# Altium schematic sheet Voeding.SchDoc
size A4; SheetNumber: 3; SheetTotal: 5
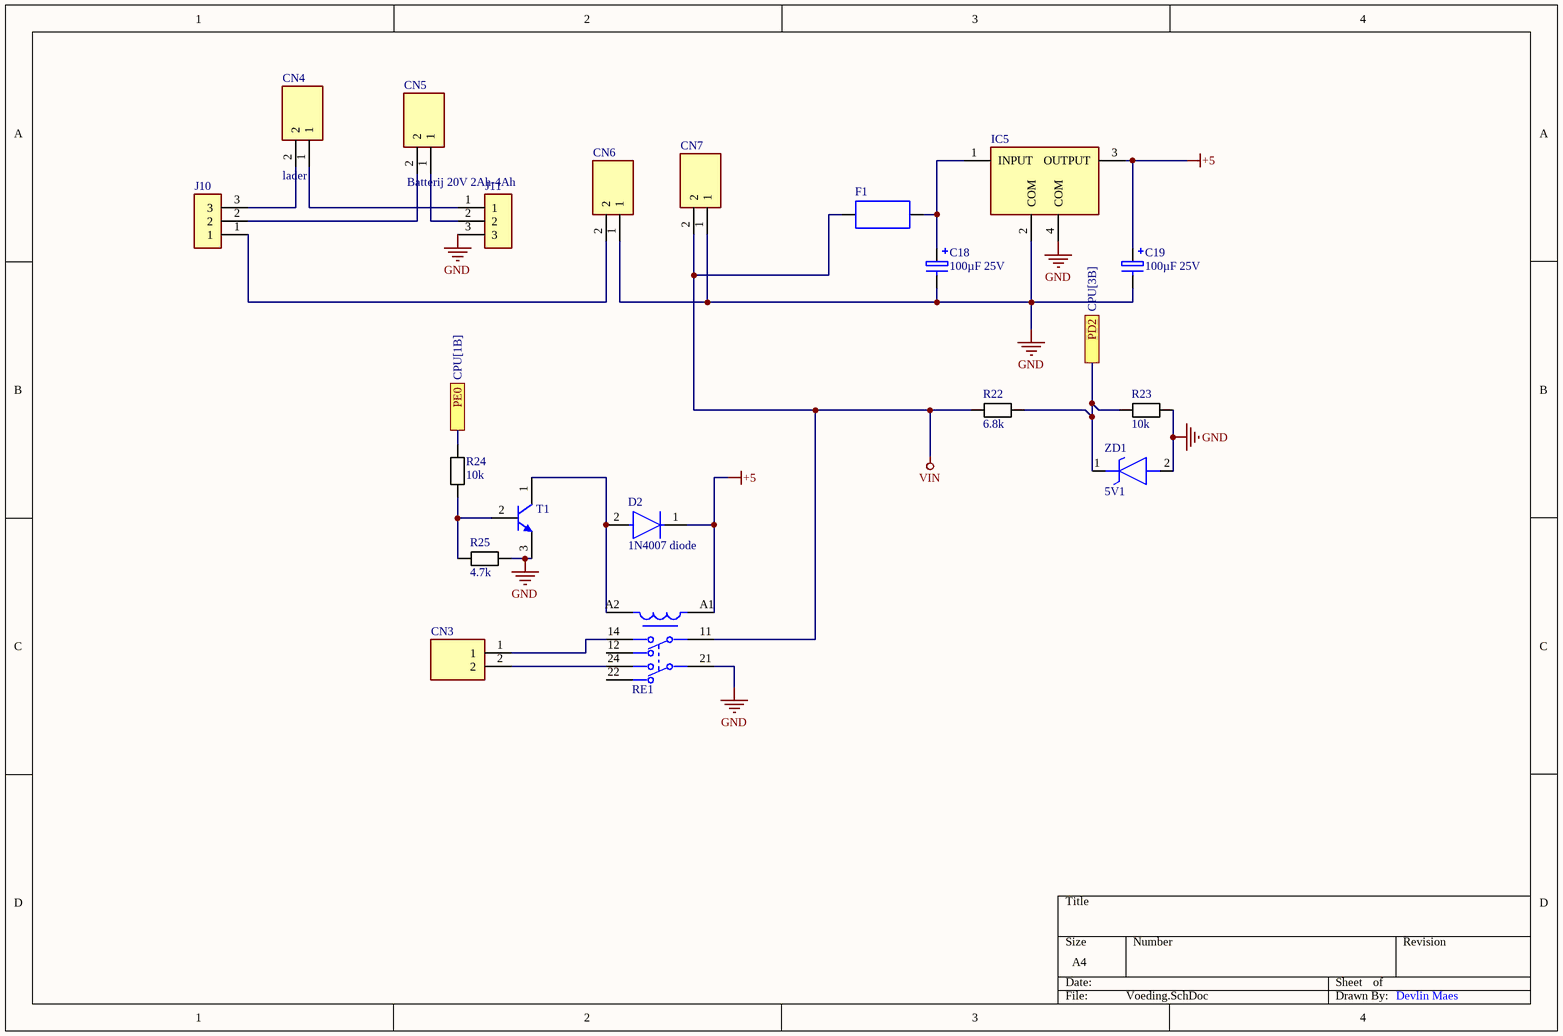
[diagram p0: Voeding.SchDoc]

## Parts
C18  100µF 25V  [Elco 100uF 25V]
C19  100µF 25V  [Elco 100uF 25V]
CN3  282836-2  [Schroefconnector 2 Pin - duplicate]  (value not drawn)
CN4  lader  [Schroefconnector 2 Pin - duplicate]
CN5  Batterij 20V 2Ah-4Ah  [Schroefconnector 2 Pin - duplicate]
CN6  282836-2  [Schroefconnector 2 Pin - duplicate]  (value not drawn)
CN7  282836-2  [Schroefconnector 2 Pin - duplicate]  (value not drawn)
D2  1N4007 diode  [1N4007(diode)]
F1  (no value)  [FuseHolder]
IC5  TL780-05CKTTR  [DC-DC Convertor]  (value not drawn)
J10  5-146280-3  [3 Pin Header]  (value not drawn)
J11  5-146280-3  [3 Pin Header]  (value not drawn)
R22  6.8k  [weerstand]
R23  10k  [weerstand]
R24  10k  [weerstand]
R25  4.7k  [weerstand]
RE1  RT424005  [Relay RT424005]  (value not drawn)
T1  BC547C  [BC547C (transistor)]  (value not drawn)
ZD1  5V1  [Zener diode]

## Ports
PD2 (see CPU[3B]), PE0 (see CPU[1B])

## Nets
+5: C19.1 D2.1(C) IC5.3(OUTPUT) RE1.A1
GND: C18.2 C19.2 CN6.1 CN7.1 IC5.2(COM) IC5.4(COM) J11.3 R23.1 R25.1 RE1.21 T1.3(E) ZD1.2(A)
VIN: CN7.2 F1.1 R22.2 RE1.11
PD2: R22.1 R23.2 ZD1.1(K) ; port PD2
PE0: R24.2 ; port PE0
NetC18_1: C18.1 F1.2 IC5.1(INPUT)
NetCN3_1: CN3.1 RE1.14
NetCN3_2: CN3.2 RE1.24
NetCN4_1: CN4.1 J11.1
NetCN4_2: CN4.2 J10.3
NetCN5_1: CN5.1 J11.2
NetCN5_2: CN5.2 J10.2
NetCN6_2: CN6.2 J10.1
NetD2_2: D2.2(A) RE1.A2 T1.1(C)
NetR24_1: R24.1 R25.2 T1.2(B)

Not connected (* = marked no-connect by the designer): RE1 12 22

## Notes on the sheet
- Devlin Maes

## Library data of the parts
C18 C19 = Condensator Elco: Part Number: 02015A270JAT2A; Manufacturer: AVX Interconnect / Elco
CN3 CN6 CN7 = Schroefconnector 2 Pin L: Connector; Manufacturer_Name: TE Connectivity; Datasheet Link: https://www.te.com/commerce/DocumentDelivery/DDEController?Action=showdoc&DocId=Customer+Drawing%7F282836%7FJ%7Fpdf%7FEnglish%7FENG_CD_282836_J.pdf%7F282836-2; Height: 10mm; Manufacturer_Part_Number: 282836-2
CN4 CN5 = Schroefconnector 2 Pin L: Connector; Manufacturer_Name: TE Connectivity; Manufacturer_Part_Number: 282836-2; Datasheet Link: https://www.te.com/commerce/DocumentDelivery/DDEController?Action=showdoc&DocId=Customer+Drawing%7F282836%7FJ%7Fpdf%7FEnglish%7FENG_CD_282836_J.pdf%7F282836-2; Height: 10mm
D2 = 1N4007 diode: Rectifier diode 1000 V 1 A DO-41, ,; Manufacturer: Diotec; Max Surge Forward Current: 27A; Forward Current: 1A; Max Junction Temp: +175°C; Reverse Voltage: 1000V; Value: 15pF; Peak Reverse Current: 5uA; Category: Diode; Temperature Range Low: -50°C; Automotive: No; Temperature: -50°C to +175°C; Lead Free: Yes; ComponentLink2Description: Datasheet; Max Repetitive Reverse Voltage: 1000V; ComponentLink2URL: https://datasheet.octopart.com/1N4007-Diotec-datasheet-62346875.pdf; Manufacturer Part Number: 1N4007; Device Class L3: Rectifier Diodes; Height: 2.8mm; Octopart: https://octopart.com/1n4007-diotec-4040411; Package: 1N4007; Temperature Range High: +175°C; Device Class L1: Discrete Semiconductors; Device Class L2: Diodes; RoHS: TRUE; Capacitance: 15pF; Ipc Land Pattern Name: DIOAD888W100L520D280
F1 = FuseHolder: NexarPartId: 56808803; Fuse Current: 10A; Voltage Rating (AC): 250V; RoHS: Non-Compliant; Max Operating Temperature: 120°C; Min Operating Temperature: -30°C; Mount: Through Hole; Packaging: Box; Height: 13.6mm; REACH SVHC: Unknown
IC5 = DC/DC Convertor: IC REG LIN 5V 1.5A DDPAK/TO263-3; Max Input Voltage: 25V; Number of Outputs: 1; Dropout Voltage: 2V; Polarity: Positive; Output Type: Fixed; Quiescent Current: 8mA; Min Input Voltage: 7V; Power Supply Rejection Ratio (PSRR): 85dB; Accuracy: 1%; Lead Free: Lead Free; Min Operating Temperature: 0°C; Number of Pins: 3; Max Output Voltage: 5V; Case/Package: TO-263; Number of Regulators: 1; Packaging: Tape and Reel; Max Operating Temperature: 125°C; Max Output Current: 1.5A; Nominal Output Voltage: 5V; Height: 4.83mm; Mount: Surface Mount; Weight: 0.050897oz; Output Current: 1.5A; Width: 9.65mm; Output Voltage: 5V; Length: 10.67mm; REACH SVHC: No SVHC; Output Voltage Accuracy: 1%; Package Quantity: 1
J10 J11 = 3 Pin Header R: Connector 5-146280-3; Manufacturer_Name: TE Connectivity; Datasheet Link: https://componentsearchengine.com//5-146280-3.pdf; Height: 8.21mm; Mouser2 Part Number: 571-5-146280-3; Mouser2 Price/Stock: https://www.mouser.com/Search/Refine.aspx?Keyword=571-5-146280-3; Manufacturer_Part_Number: 5-146280-3
R22-R25 = weerstand: Manufacturer: Vishay Dale; Part Number: CRCW08050000Z0EA
RE1 = Relay: RELAY GENERAL PURPOSE DPDT 8A 5V; Manufacturer: TE Connectivity; Coil Power: 403mW; Number Of Contacts: 2; Coil Resistance: 62Ω; Coil Type: Non-Latching; Manufacturer Part Number: RT424005; Category: Relay; Octopart: https://octopart.com/5-1393243-9-te+connectivity-41835766; Device Class L3: Power Relays; ComponentLink2URL: https://www.te.com/commerce/DocumentDelivery/DDEController?Action=showdoc&DocId=Data+Sheet%7FRT2%7F1014%7Fpdf%7FEnglish%7FENG_DS_RT2_1014.pdf%7F5-1393243-9; Ambient Temperature Range High: +85°C; ComponentLink2Description: Datasheet; Throw Configuration: DPDT; Digikey Description: RELAY GENERAL PURPOSE DPDT 8A 5V; Package: RT424005; Automotive: No; Device Class L1: Electromechanical; Height: 15.7mm; Device Class L2: Relays; Ambient Temperature Range Low: -40°C; Coil Voltage: 5V; Current Rating: 8A; Mouser Description: General Purpose Relay, Rt2 Series, Power, Non Latching, Dpdt, 5 Vdc, 8 A Rohs Compliant: Yes; Lead Free: Yes; RoHS: TRUE
T1 = BC547C: Amplifier Transistor, NPN Silicon, 3-Pin, 0,1A TO-92, Bulk Box; Manufacturer: On Semiconductor; IC Continuous (A): 0.1; fT Min (MHz): 150; Mounting Technology: Through Hole; ComponentLink1URL: http://www.onsemi.com/; ComponentLink1Description: Manufacturer URL; ComponentLink3URL: http://www.onsemi.cn/pub_link/Collateral/2N6426-D.PDF; DatasheetVersion: Rev. 7; PackageVersion: Rev. AM; Packing: Bulk Box; RoHS: FALSE; Polarity: NPN; PartNumber: BC547C; ComponentLink2URL: http://www.onsemi.com/pub_link/Collateral/BC546-D.PDF; ComponentLink3Description: Package Specification; PackageDescription: 3-Pin Transistor Outline, Body 4.825 x 3.685 mm, Pitch 1.27 mm; PackageReference: TO-92-3-29-11_AM_SL; ComponentLink2Description: Datasheet
ZD1 = Zenerdiode: Zener Diode; Manufacturer_Name: ON Semiconductor; Manufacturer_Part_Number: 1N5231CTR; Datasheet Link: https://componentsearchengine.com//1N5231CTR.pdf; Mouser2 Part Number: 512-1N5231CTR; Mouser2 Price/Stock: https://www.mouser.com/Search/Refine.aspx?Keyword=512-1N5231CTR